# EAGLE schematic WifiLamp_Hardware (EAGLE 7.1.0)
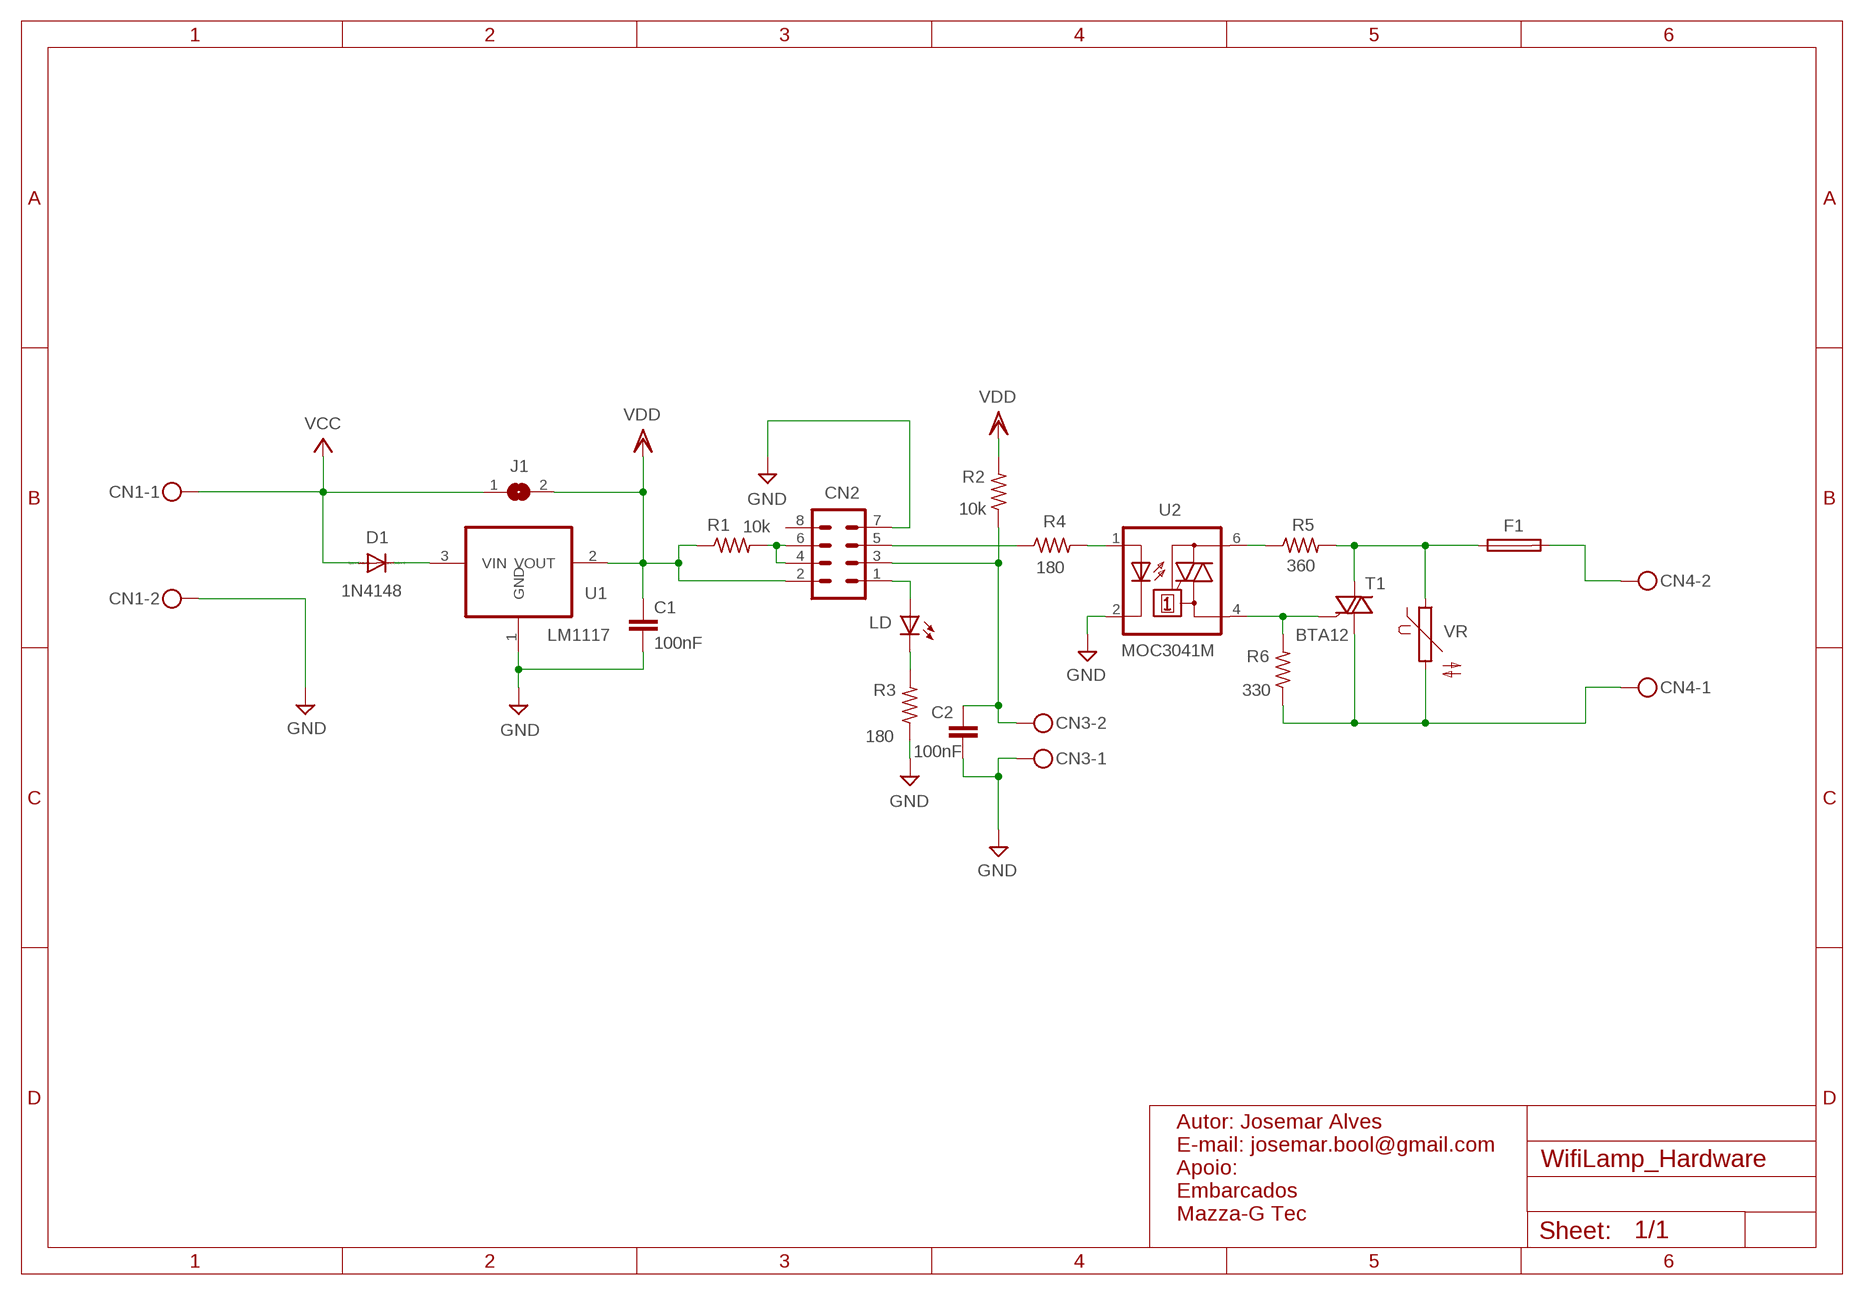
[diagram p0: schematic, sheet 1]

## Parts
C1  100nF  C-EUC0805K  [C0805K]
C2  100nF  C-EUC0805K  [C0805K]
CN1  MKDSN1,5/2-5,08  [MKDSN1,5/2-5,08]
CN2  MA04-2  [MA04-2]
CN3  MKDSN1,5/2-5,08  [MKDSN1,5/2-5,08]
CN4  MKDSN1,5/2-5,08  [MKDSN1,5/2-5,08]
D1  1N4148  DIODE-D-5  [D-5]
F1  FUSETR5  [TR5]
J1  SJ  [SJ]
LD  LED3MM  [LED3MM]
R1  10k  R-US_0309/V  [0309V]
R2  10k  R-US_0309/V  [0309V]
R3  180  R-US_0207/10  [0207/10]
R4  180  R-US_0309/V  [0309V]
R5  360  R-US_0309/V  [0309V]
R6  330  R-US_0411/3V  [0411V]
T1  BTA12  BT138-V  [TO220BV]
U1  LM1117  REG1117  [SOT223]
U2  MOC3041M  [DIL06]
VR  S07K230  [S07K230]

## Nets
FS: F1.1 R5.2 T1.T2(A2) VR.1
GND: C1.2 C2.2 CN1.2 CN2.7 CN3.1 R3.1 U1.1(GND) U2.2(C)
N$1: R5.1 U2.6(A2)
N$2: R6.2 T1.G U2.4(A1)
N$3: R4.2 U2.1(A)
N$5: CN2.6 R1.2
N$7: CN4.2 F1.2
N$8: CN2.5 R4.1
N$9: D1.C U1.3(VIN)
N$50: C2.1 CN2.3 CN3.2 R2.1
N$66: CN2.1 LD.A
N$69: LD.K(C) R3.2
N$70: CN1.1 D1.A J1.1 ; supply symbol labelled VCC
N$72: CN4.1 R6.1 T1.T1(A1) VR.2
N$89: C1.1 CN2.2 J1.2 R1.1 R2.2 U1.2(VOUT) ; supply symbol labelled VDD
Unconnected: CN2.4 CN2.8

## Notes on the sheet
- Autor: Josemar Alves
  E-mail: josemar.bool@gmail.com
  Apoio:
  Embarcados
  Mazza-G Tec

## Library data of the parts
C1 C2 = rcl:C-EU: CAPACITOR, European symbol
CN1 CN3 CN4 = con-phoenix-508:MKDSN1,5/2-5,08: MKDSN 1,5/ 2-5,08 Printklemme Nennstrom: 13,5 A Nennspannung: 250 V Rastermaß: 5,08 mm Polzahl: 2 Anschlussart: Schraubanschluss Montage: Löten Anschlussrichtung Leiter/Platine: 0 ° Artikelnummer: 1729128 Source: http://eshop.phoenixcontact.com .. 1729128.pdf
CN2 = con-lstb:MA04-2: PIN HEADER; OC_FARNELL: unknown; OC_NEWARK: unknown
D1 = diode:DIODE-: DIODE
F1 = fuse:FUSE: Fuse; OC_FARNELL: unknown; OC_NEWARK: unknown
J1 = jumper:SJ: SMD solder JUMPER
LD = led:LED: LED OSRAM: - CHIPLED LG R971, LG N971, LY N971, LG Q971, LY Q971, LO R971, LY R971 LH N974, LH R974 LS Q976, LO Q976, LY Q976 LO Q996 - Hyper CHIPLED LW Q18S LB Q993, LB Q99A, LB R99A - SideLED LS A670, LO A670, LY A670, LG A670, LP A670 LB A673, LV A673, LT A673, LW A673 LH A674 LY A675 LS A676, LA A676, LO A676, LY A676, LW A676 LS A679, LY A679, LG A679 - Hyper Micro SIDELED® LS Y876, LA Y876, LO Y876, LY Y876 LT Y87S - SmartLED LW L88C, LW L88S LB L89C, LB L89S, LG L890 LS L89K, LO L89K, LY L89K LS L896, LA L896, LO L896, LY L896 - TOPLED LS T670, LO T670, LY T670, LG T670, LP T670 LSG T670, LSP T670, LSY T670, LOP T670, LYG T670 LG T671, LOG T671, LSG T671 LB T673, LV T673, LT T673, LW T673 LH T674 LS T676, LA T676, LO T676, LY T676, LB T676, LH T676, LSB T676, LW T676 LB T67C, LV T67C, LT T67C, LS T67K, LO T67K, LY T67K, LW E67C LS E67B, LA E67B, LO E67B, LY E67B, LB E67C, LV E67C, LT E67C LW T67C LS T679, LY T679, LG T679 LS T770, LO T770, LY T770, LG T770, LP T770 LB T773, LV T773, LT T773, LW T773 LH T774 LS E675, LA E675, LY E675, LS T675 LS T776, LA T776, LO T776, LY T776, LB T776 LHGB T686 LT T68C, LB T68C - Hyper Mini TOPLED® LB M676 - Mini TOPLED Santana® LG M470 LS M47K, LO M47K, LY M47K Source: http://www.osram.convergy.de LUXEON: - LUMILED® LXK2-PW12-R00, LXK2-PW12-S00, LXK2-PW14-U00, LXK2-PW14-V00 LXK2-PM12-R00, LXK2-PM12-S00, LXK2-PM14-U00 LXK2-PE12-Q00, LXK2-PE12-R00, LXK2-PE12-S00, LXK2-PE14-T00, LXK2-PE14-U00 LXK2-PB12-K00, LXK2-PB12-L00, LXK2-PB12-M00, LXK2-PB14-N00, LXK2-PB14-P00, LXK2-PB14-Q00 LXK2-PR12-L00, LXK2-PR12-M00, LXK2-PR14-Q00, LXK2-PR14-R00 LXK2-PD12-Q00, LXK2-PD12-R00, LXK2-PD12-S00 LXK2-PH12-R00, LXK2-PH12-S00 LXK2-PL12-P00, LXK2-PL12-Q00, LXK2-PL12-R00 Source: www.luxeon.com KINGBRIGHT: KA-3528ASYC Source: www.kingbright.com
R1-R6 = resistor:R-US_: RESISTOR, American symbol
T1 = triac:BT138: TRIAC Source: http://www.semiconductors.philips.com BT138_SERIES_2.pdf
U1 = burr-brown:REG1117: 800mA and 1A Low Dropout (LDO) Positive Regulator 1.8V, 2.5V, 2.85V, 3.3V, 5V, and Adj; MPN: REG1117; OC_FARNELL: 1097566; OC_NEWARK: 14P6981
U2 = optocoupler:MOC30*: 6-Pin DIP Zero-Cross Optoisolators Triac Driver Output (250/400 Volt Peak) Source: Data sheet <http://www.fairchildsemi.com/ds/MO/MOC3031M.pdf> The old path of data sheet not more available 2013-05-06.; MF: FAIRCHILD SEMICONDUCTOR; MPN: MOC3041M; OC_FARNELL: 1086677; OC_NEWARK: 78K6090
VR = varistor:S07K230: VARISTOR